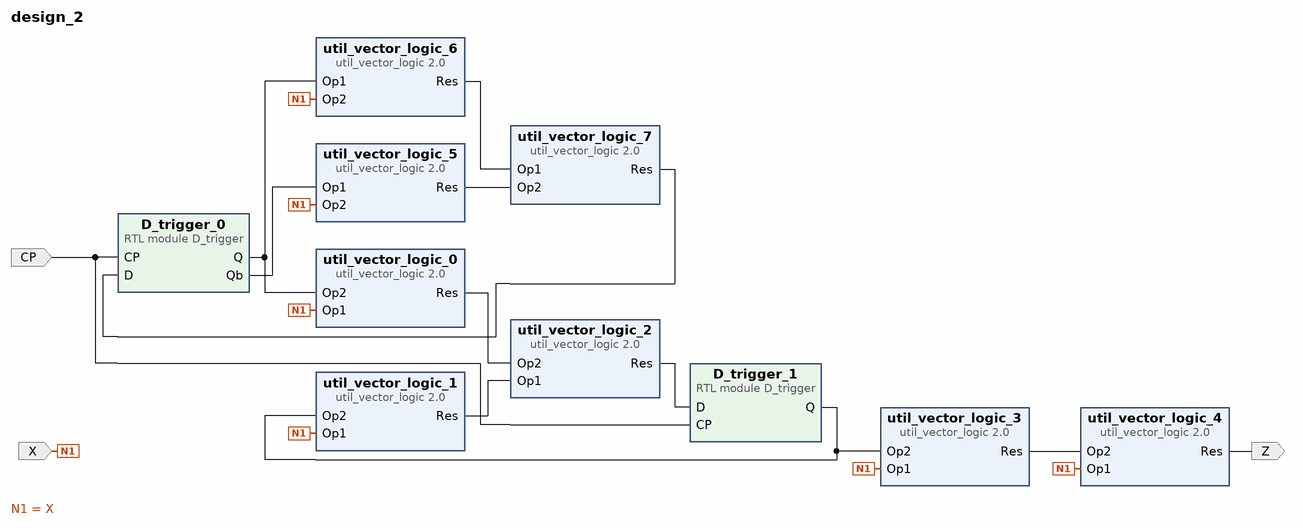
[diagram p0: block diagram of the top level]
# Vivado block design design_2, xc7a100tfgg484-1, Vivado 2018.3
create_bd_design design_2

create_bd_port -dir I -type clk CP
create_bd_port -dir I -type data X
create_bd_port -dir O -type data Z

create_bd_cell -type module -reference D_trigger D_trigger_0
create_bd_cell -type module -reference D_trigger D_trigger_1
create_bd_cell -type ip -vlnv xilinx.com:ip:util_vector_logic:2.0 util_vector_logic_0
set_property -dict {CONFIG.C_SIZE 1} [get_bd_cells util_vector_logic_0]
create_bd_cell -type ip -vlnv xilinx.com:ip:util_vector_logic:2.0 util_vector_logic_1
set_property -dict {CONFIG.C_SIZE 1} [get_bd_cells util_vector_logic_1]
create_bd_cell -type ip -vlnv xilinx.com:ip:util_vector_logic:2.0 util_vector_logic_2
set_property -dict {CONFIG.C_OPERATION or CONFIG.C_SIZE 1} [get_bd_cells util_vector_logic_2]
create_bd_cell -type ip -vlnv xilinx.com:ip:util_vector_logic:2.0 util_vector_logic_3
set_property -dict {CONFIG.C_SIZE 1} [get_bd_cells util_vector_logic_3]
create_bd_cell -type ip -vlnv xilinx.com:ip:util_vector_logic:2.0 util_vector_logic_4
set_property -dict {CONFIG.C_SIZE 1} [get_bd_cells util_vector_logic_4]
create_bd_cell -type ip -vlnv xilinx.com:ip:util_vector_logic:2.0 util_vector_logic_5
set_property -dict {CONFIG.C_SIZE 1} [get_bd_cells util_vector_logic_5]
create_bd_cell -type ip -vlnv xilinx.com:ip:util_vector_logic:2.0 util_vector_logic_6
set_property -dict {CONFIG.C_SIZE 1} [get_bd_cells util_vector_logic_6]
create_bd_cell -type ip -vlnv xilinx.com:ip:util_vector_logic:2.0 util_vector_logic_7
set_property -dict {CONFIG.C_OPERATION or CONFIG.C_SIZE 1} [get_bd_cells util_vector_logic_7]

# ---- connections ----

connect_bd_net [get_bd_pins util_vector_logic_1/Res] [get_bd_pins util_vector_logic_2/Op1]
connect_bd_net [get_bd_pins util_vector_logic_0/Res] [get_bd_pins util_vector_logic_2/Op2]
connect_bd_net [get_bd_ports X] \
  [get_bd_pins util_vector_logic_0/Op1] [get_bd_pins util_vector_logic_1/Op1] [get_bd_pins util_vector_logic_3/Op1] \
  [get_bd_pins util_vector_logic_4/Op1] [get_bd_pins util_vector_logic_5/Op2] [get_bd_pins util_vector_logic_6/Op2]
connect_bd_net [get_bd_pins D_trigger_0/Q] [get_bd_pins util_vector_logic_0/Op2] [get_bd_pins util_vector_logic_6/Op1]
connect_bd_net [get_bd_pins D_trigger_1/Q] [get_bd_pins util_vector_logic_1/Op2] [get_bd_pins util_vector_logic_3/Op2]
connect_bd_net [get_bd_pins util_vector_logic_3/Res] [get_bd_pins util_vector_logic_4/Op2]
connect_bd_net [get_bd_pins util_vector_logic_4/Res] [get_bd_ports Z]
connect_bd_net [get_bd_ports CP] [get_bd_pins D_trigger_0/CP] [get_bd_pins D_trigger_1/CP]
connect_bd_net [get_bd_pins util_vector_logic_2/Res] [get_bd_pins D_trigger_1/D]
connect_bd_net [get_bd_pins util_vector_logic_5/Res] [get_bd_pins util_vector_logic_7/Op2]
connect_bd_net [get_bd_pins util_vector_logic_6/Res] [get_bd_pins util_vector_logic_7/Op1]
connect_bd_net [get_bd_pins util_vector_logic_7/Res] [get_bd_pins D_trigger_0/D]
connect_bd_net [get_bd_pins D_trigger_0/Qb] [get_bd_pins util_vector_logic_5/Op1]

validate_bd_design
save_bd_design
